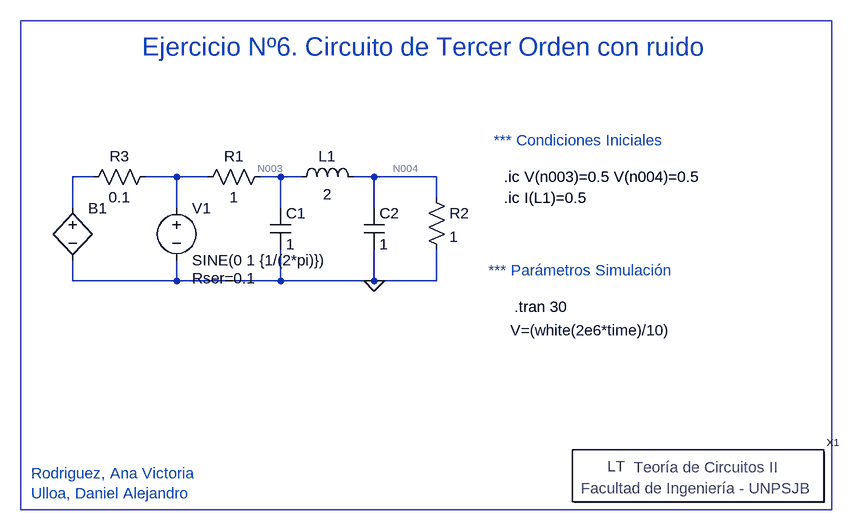
[diagram p0: schematic 06.asc]
06.asc, the LTspice schematic file:
Version 4
SHEET 1 980 680
WIRE -160 -16 -192 -16
WIRE -32 -16 -80 -16
WIRE 16 -16 -32 -16
WIRE 128 -16 96 -16
WIRE 160 -16 128 -16
WIRE 272 -16 240 -16
WIRE 368 -16 272 -16
WIRE 368 16 368 -16
WIRE -192 32 -192 -16
WIRE -32 32 -32 -16
WIRE 128 32 128 -16
WIRE 272 32 272 -16
WIRE -192 144 -192 112
WIRE -32 144 -32 112
WIRE -32 144 -192 144
WIRE 128 144 128 96
WIRE 128 144 -32 144
WIRE 272 144 272 96
WIRE 272 144 128 144
WIRE 368 144 368 96
WIRE 368 144 272 144
FLAG 272 144 0
SYMBOL Circuitos2\\Letreros\\Teoría\ de\ Circuitos\ II 768 448 R0
SYMATTR InstName X1
SYMBOL res 112 -32 R90
WINDOW 0 0 56 VBottom 2
WINDOW 3 32 56 VTop 2
SYMATTR InstName R1
SYMATTR Value 1
SYMBOL cap 112 32 R0
SYMATTR InstName C1
SYMATTR Value 1
SYMBOL ind 144 0 R270
WINDOW 0 32 56 VTop 2
WINDOW 3 5 56 VBottom 2
SYMATTR InstName L1
SYMATTR Value 2
SYMBOL cap 256 32 R0
SYMATTR InstName C2
SYMATTR Value 1
SYMBOL res 352 0 R0
SYMATTR InstName R2
SYMATTR Value 1
SYMBOL voltage -32 16 R0
WINDOW 123 0 0 Left 0
WINDOW 39 24 124 Left 2
SYMATTR SpiceLine Rser=0.1
SYMATTR InstName V1
SYMATTR Value SINE(0 1 {1/(2*pi)})
SYMBOL bv -192 16 R0
WINDOW 3 674 204 Left 2
SYMATTR Value V=(white(2e6*time)/10)
SYMATTR InstName B1
SYMBOL res -64 -32 R90
WINDOW 0 0 56 VBottom 2
WINDOW 3 32 56 VTop 2
SYMATTR InstName R3
SYMATTR Value 0.1
TEXT 488 184 Left 2 !.tran 30
TEXT 472 -16 Left 2 !.ic V(n003)=0.5 V(n004)=0.5
TEXT 472 16 Left 2 !.ic I(L1)=0.5
TEXT 352 -216 Center 4 ;Ejercicio Nº6. Circuito de Tercer Orden con ruido
TEXT -256 440 Left 2 ;Rodriguez, Ana Victoria\nUlloa, Daniel Alejandro
TEXT 456 -72 Left 2 ;*** Condiciones Iniciales
TEXT 448 128 Left 2 ;*** Parámetros Simulación
RECTANGLE Normal 976 496 -272 -256

The netlist it stands for:
* 06.asc
XX1 Teoría de Circuitos II
R1 N003 N002 1
C1 N003 0 1
L1 N003 N004 2
C2 N004 0 1
R2 N004 0 1
V1 N002 0 SINE(0 1 {1/(2*pi)}) Rser=0.1
B1 N001 0 V=(white(2e6*time)/10)
R3 N002 N001 0.1
.tran 30
.ic V(n003)=0.5 V(n004)=0.5
.ic I(L1)=0.5
* Ejercicio Nº6. Circuito de Tercer Orden con ruido
* Rodriguez, Ana Victoria
* Ulloa, Daniel Alejandro
* *** Condiciones Iniciales
* *** Parámetros Simulación
.backanno
.end